# EAGLE design SNES-ModChip-v1 (EAGLE 6.5.0)
CNAME: SNES ModChip; CREVISION: A; DESIGNER: Philip Dubois
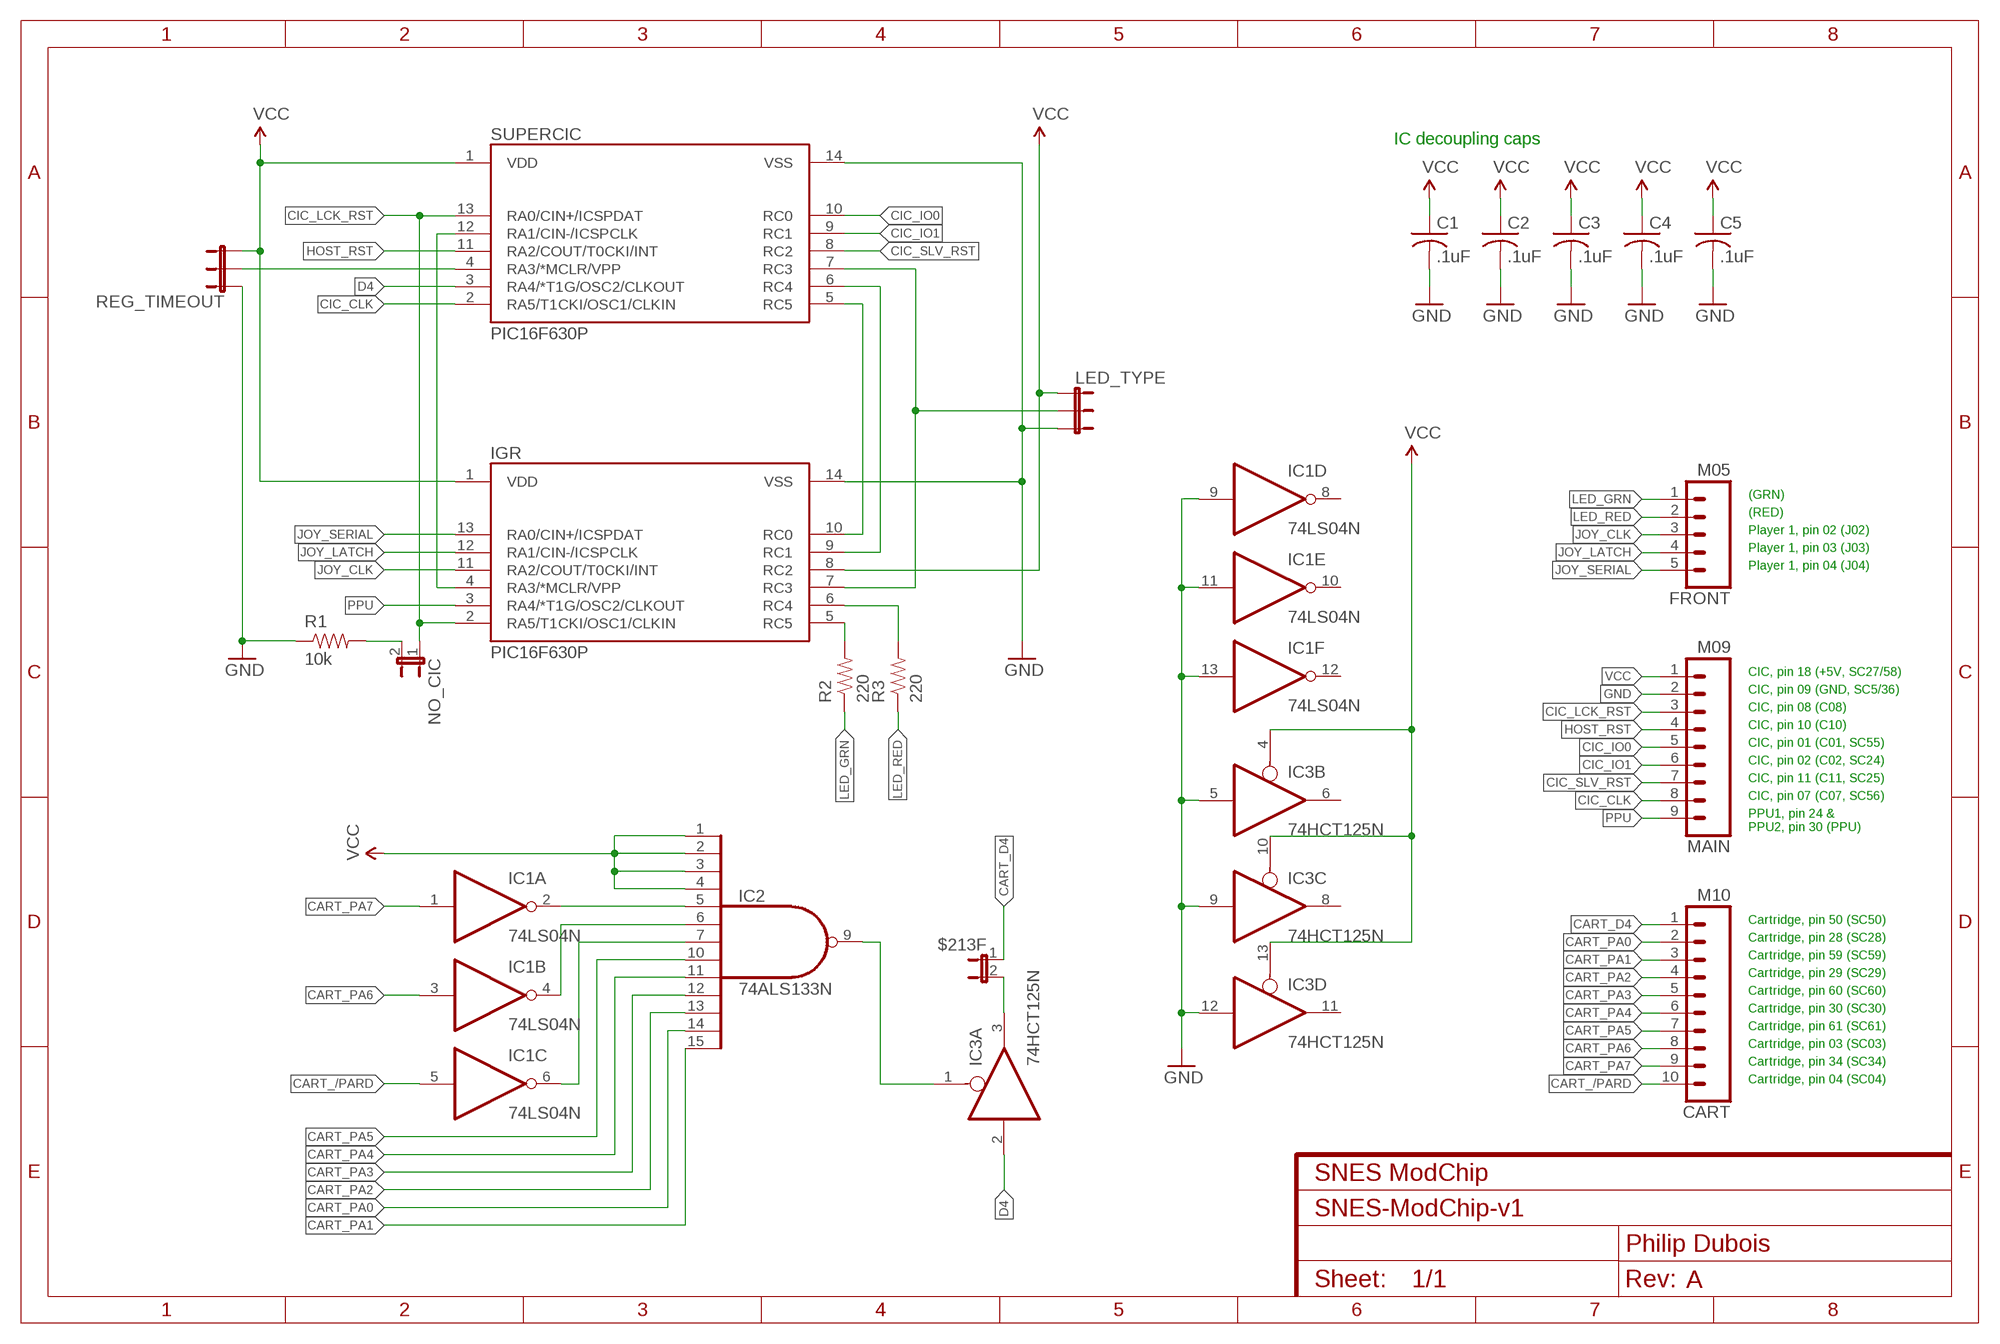
[diagram p0: schematic, sheet 1]

## Parts
$213F  JUMPER-2PTH  [1X02]
C1  .1uF  C-US050-025X075  [C050-025X075]
C2  .1uF  C-US050-025X075  [C050-025X075]
C3  .1uF  C-US050-025X075  [C050-025X075]
C4  .1uF  C-US050-025X075  [C050-025X075]
C5  .1uF  C-US050-025X075  [C050-025X075]
CART  M10  [1X10]
FRONT  M05  [1X05]
IC1  74LS04N  [DIL14]
IC2  74ALS133N  [DIL16]
IC3  74HCT125N  [DIL14]
IGR  PIC16F630P  [DIL14]
LED_TYPE  JUMPER-3PTH  [1X03]
MAIN  M09  [1X09]
NO_CIC  JUMPER-2PTH  [1X02]
R1  10k  RESISTORPTH  [AXIAL-0.3]
R2  220  RESISTORPTH  [AXIAL-0.3]
R3  220  RESISTORPTH  [AXIAL-0.3]
REG_TIMEOUT  JUMPER-3PTH  [1X03]
SUPERCIC  PIC16F630P  [DIL14]

## Nets
CART_/PARD: CART.10 IC1.5(C:I)
CART_D4: $213F.1 CART.1
CART_PA0: CART.2 IC2.14(I11)
CART_PA1: CART.3 IC2.15(I12)
CART_PA2: CART.4 IC2.13(I10)
CART_PA3: CART.5 IC2.12(I9)
CART_PA4: CART.6 IC2.11(I8)
CART_PA5: CART.7 IC2.10(I7)
CART_PA6: CART.8 IC1.3(B:I)
CART_PA7: CART.9 IC1.1(A:I)
CIC_CLK: MAIN.8 SUPERCIC.2(RA5/T1CKI/OSC1/CLKIN)
CIC_IO0: MAIN.5 SUPERCIC.10(RC0)
CIC_IO1: MAIN.6 SUPERCIC.9(RC1)
CIC_LCK_RST: IGR.2(RA5/T1CKI/OSC1/CLKIN) MAIN.3 NO_CIC.1 SUPERCIC.13(RA0/CIN+/ICSPDAT)
CIC_SLV_RST: MAIN.7 SUPERCIC.8(RC2)
D4: IC3.2(A:I) SUPERCIC.3(RA4/*T1G/OSC2/CLKOUT)
GND: C1.2 C2.2 C3.2 C4.2 C5.2 IC1.9(D:I) IC1.11(E:I) IC1.13(F:I) IC3.5(B:I) IC3.9(C:I) IC3.12(D:I) IGR.14(VSS) LED_TYPE.3 MAIN.2 R1.P$1 REG_TIMEOUT.1 SUPERCIC.14(VSS)
HOST_RST: MAIN.4 SUPERCIC.11(RA2/COUT/T0CKI/INT)
JOY_CLK: FRONT.3 IGR.11(RA2/COUT/T0CKI/INT)
JOY_LATCH: FRONT.4 IGR.12(RA1/CIN-/ICSPCLK)
JOY_SERIAL: FRONT.5 IGR.13(RA0/CIN+/ICSPDAT)
LED_GRN: FRONT.1 R2.P$1
LED_RED: FRONT.2 R3.P$1
N$1: IGR.10(RC0) SUPERCIC.5(RC5)
N$2: IGR.9(RC1) SUPERCIC.6(RC4)
N$5: IC1.2(A:O) IC2.5(I4)
N$6: IGR.4(RA3/*MCLR/VPP) SUPERCIC.12(RA1/CIN-/ICSPCLK)
N$7: IC1.4(B:O) IC2.6(I5)
N$8: IC1.6(C:O) IC2.7(I6)
N$9: REG_TIMEOUT.2 SUPERCIC.4(RA3/*MCLR/VPP)
N$10: IGR.7(RC3) LED_TYPE.2 SUPERCIC.7(RC3)
N$11: NO_CIC.2 R1.P$2
N$12: $213F.2 IC3.3(A:O)
N$13: IGR.5(RC5) R2.P$2
N$14: IGR.6(RC4) R3.P$2
N$19: IC2.9(O) IC3.1(A:OE)
PPU: IGR.3(RA4/*T1G/OSC2/CLKOUT) MAIN.9
VCC: C1.1 C2.1 C3.1 C4.1 C5.1 IC2.1(I0) IC2.2(I1) IC2.3(I2) IC2.4(I3) IC3.4(B:OE) IC3.10(C:OE) IC3.13(D:OE) IGR.1(VDD) IGR.8(RC2) LED_TYPE.1 MAIN.1 REG_TIMEOUT.3 SUPERCIC.1(VDD)
Unconnected: IC1.8(D:O) IC1.10(E:O) IC1.12(F:O) IC3.6(B:O) IC3.8(C:O) IC3.11(D:O)

## Notes on the sheet
- IC decoupling caps
- (GRN)
- (RED)
- Player 1, pin 02 (J02)
- Player 1, pin 03 (J03)
- Player 1, pin 04 (J04)
- CIC, pin 18 (+5V, SC27/58)
- CIC, pin 09 (GND, SC5/36)
- CIC, pin 08 (C08)
- CIC, pin 10 (C10)
- CIC, pin 01 (C01, SC55)
- CIC, pin 02 (C02, SC24)
- CIC, pin 11 (C11, SC25)
- CIC, pin 07 (C07, SC56)
- PPU1, pin 24 &
  PPU2, pin 30 (PPU)
- Cartridge, pin 50 (SC50)
- Cartridge, pin 28 (SC28)
- Cartridge, pin 59 (SC59)
- Cartridge, pin 29 (SC29)
- Cartridge, pin 60 (SC60)
- Cartridge, pin 30 (SC30)
- Cartridge, pin 61 (SC61)
- Cartridge, pin 03 (SC03)
- Cartridge, pin 34 (SC34)
- Cartridge, pin 04 (SC04)

## Power pins joined to a net without a drawn wire
GND: IC1.7(P:GND) IC2.8(GND) IC3.7(P:GND)
VCC: IC1.14(P:VCC) IC2.16(VCC) IC3.14(P:VCC)

## Library data of the parts
$213F NO_CIC = SparkFun-Passives:JUMPER-2: Jumper Basic 0.1" spaced jumper. Use with breakaway headers.
C1-C5 = resistor-edited:C-US: CAPACITOR, American symbol
CART = MyLibrary:M10: Header 10 Standard 10-pin 0.1" header. Use with straight break away headers, right angle break away headers, swiss pins, machine pins, and female headers.
FRONT = MyLibrary:M05: Header 5 Standard 5-pin 0.1" header. Use with straight break away headers, right angle break away headers, swiss pins, machine pins, and female headers.
IC1 = MyLibrary:74*04: Hex INVERTER These devices contain six independent inverters.
IC2 = MyLibrary:74*133: 13-input positive NAND gate These devices contain a 13-input positive-NAND gate.
IC3 = MyLibrary:74*125: Quadruple bus BUFFER gate with 3-state output These bus buffer gates feature independent line drivers with 3-state outputs. Each output is disabled when the associated output-enable (*OE) input is high. To ensure the high-impedance state during power up or power down, *OE should be tied to VCC through a pullup resistor; the minimum value of the resistor is determined by the current-sinking capability of the driver.
IGR SUPERCIC = MyLibrary:PIC16F630: Microchip PIC16F630 14-Pin, Flash-Based 8-Bit CMOS Microcontrollers
LED_TYPE REG_TIMEOUT = SparkFun-Passives:JUMPER-3
MAIN = MyLibrary:M09: Header 9 Standard 9-pin 0.1" header. Use with straight break away headers, right angle break away headers, swiss pins, machine pins, and female headers.
R1-R3 = MyLibrary:RESISTOR: Resistor Basic schematic elements and footprints for 0402, 0603, 0805, and PTH resistors.

## Net classes
0 default: width 0.508 mm, drill 0.61 mm, clearance 0.305 mm

## Board
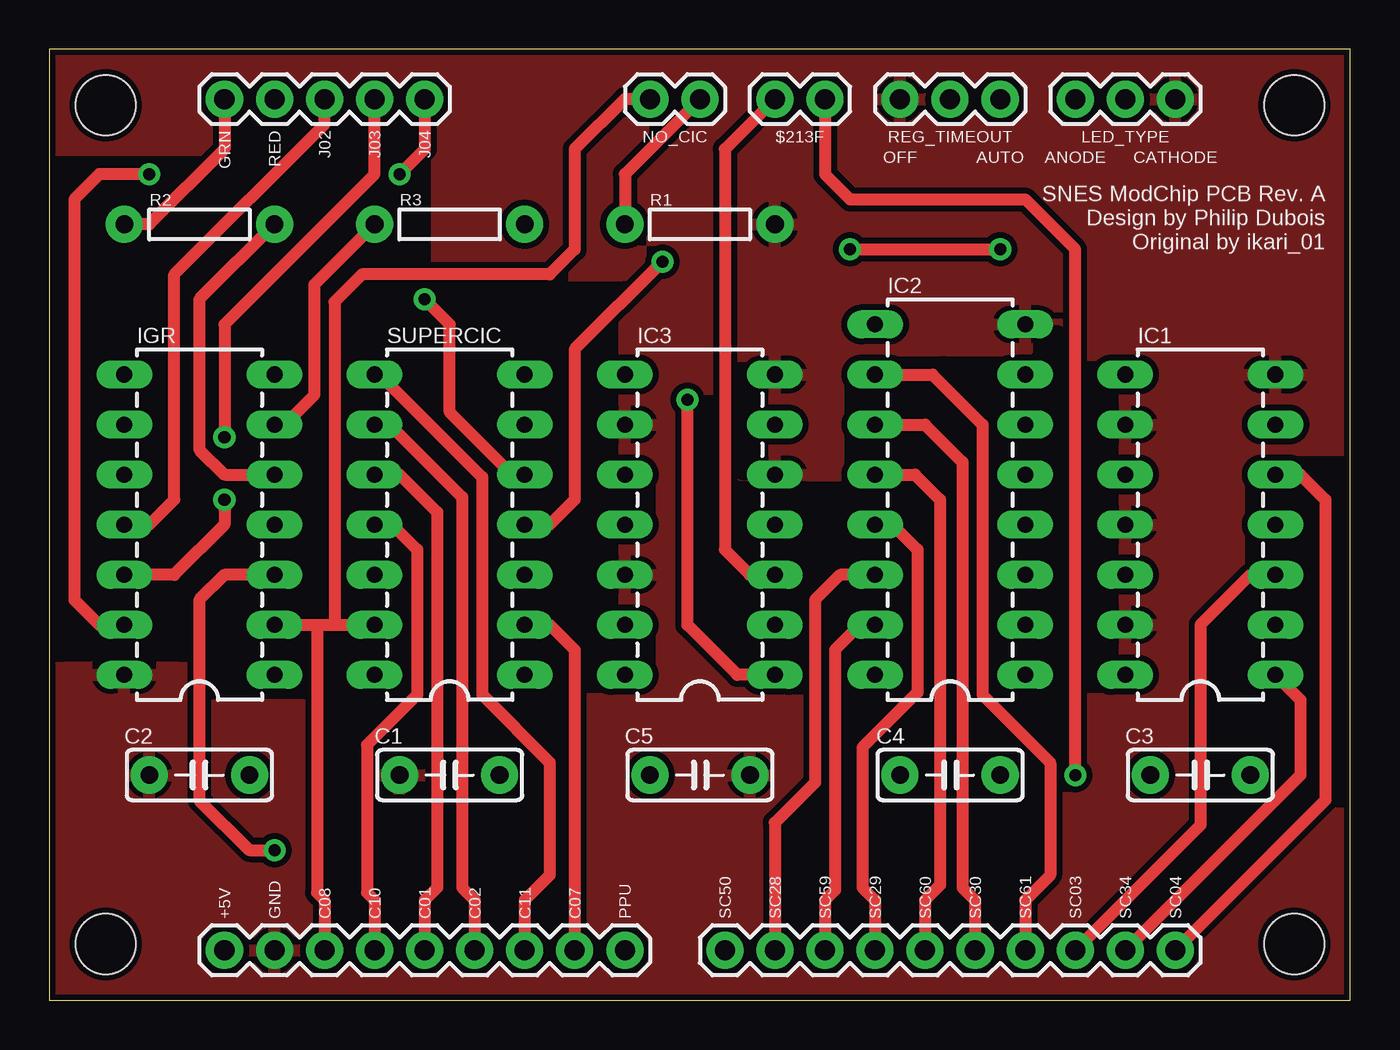
[diagram p1: board, top side]
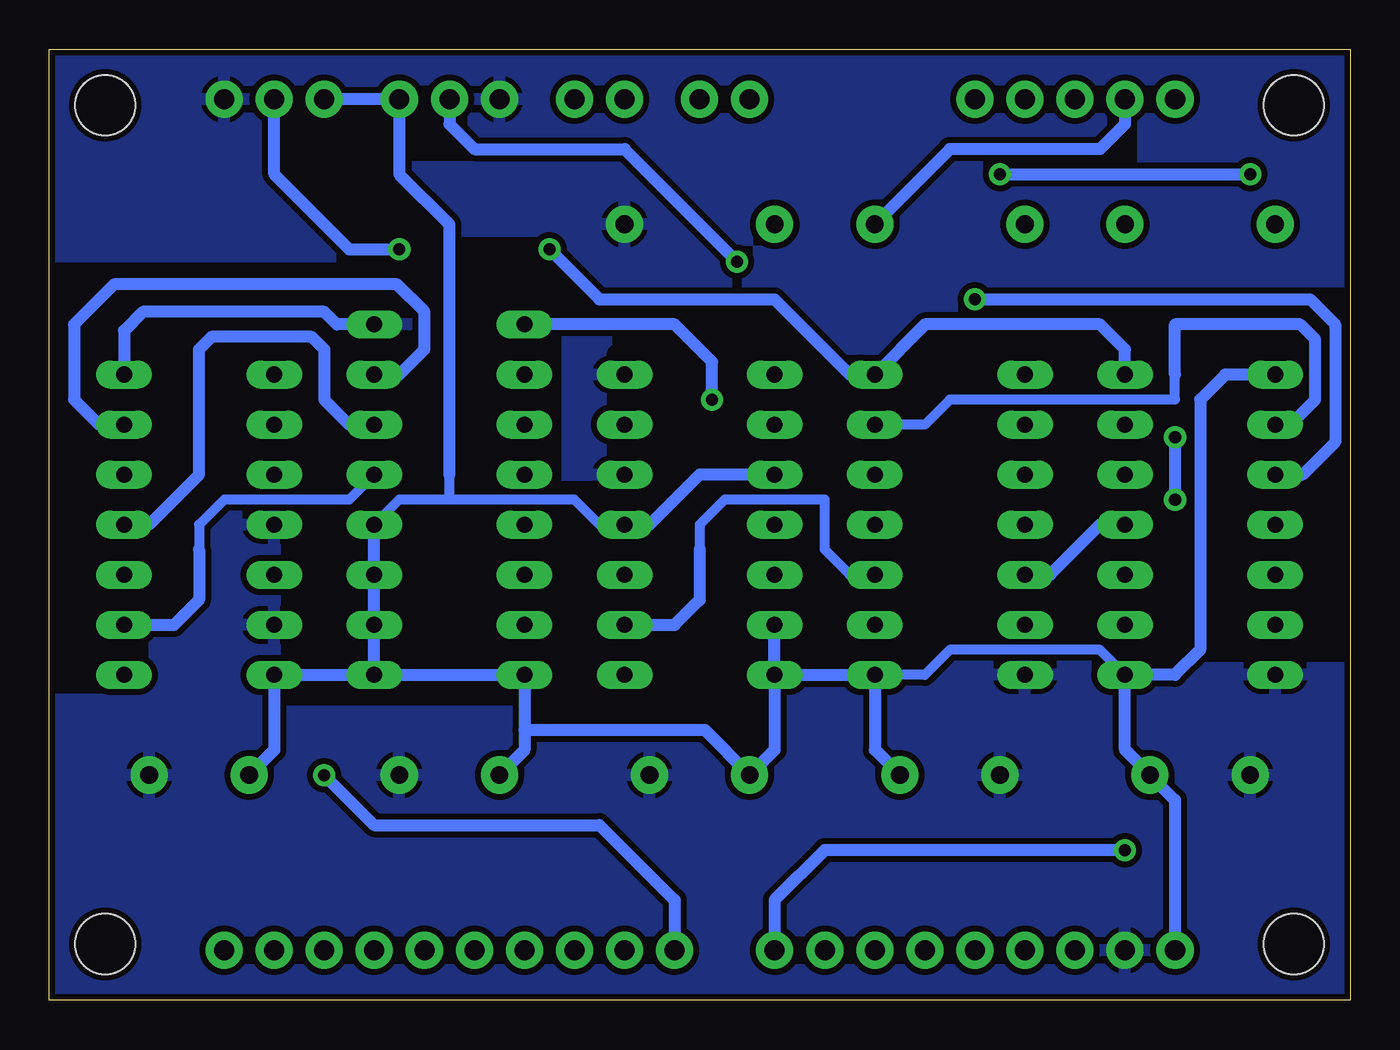
[diagram p2: board, bottom side, seen from below]

Size 66.03 x 48.25 mm. Coordinates in mm from the lower left corner, seen from the top.
Outline: 0,0 66.03,0 66.03,48.25 0,48.25 0,0
Copper layers (1*16): Top 0.035mm / dielectric 1.5mm / Bottom 0.035mm
Design rules "SparkFun-2-layer": minimum track width 7mil, minimum drill 15mil, track to track 8mil, track to pad 8mil, pad to pad 8mil, via to via 8mil, smd to smd 8mil, copper to edge 8mil, drill to drill 8mil, minimum pad ring 12mil, minimum via ring 10mil, stop-mask expansion 4mil, vias tented up to drill 20mil, thermal gap 10mil
Holes 3.05 mm at 2.86,45.4 63.18,45.4 63.18,2.86 2.86,2.86
tRestrict: area 17.1,4.1 to 18.7,9.8; area 0.6,17.8 to 6.7,20.6; area 14.6,12.7 to 17.8,18.1; area 8.6,15.9 to 13.7,29.5; area 0.6,41.6 to 8.3,42.2; area 15.6,37.8 to 18.7,42.9; area 61.3,17.1 to 65.4,27; area 59.4,8.9 to 62.9,20.3; area 53,16.2 to 53.7,31.1; area 42.9,29.5 to 51.1,33.7; area 35.2,21.6 to 44.1,25.7; area 35.2,27 to 35.9,31.8; 7 more areas
bRestrict: area 0.6,35.2 to 1.9,35.6; area 11.4,42.2 to 11.7,44.1; area 44.8,43.2 to 48.3,45.1; area 61.6,16.2 to 65.7,29.8; area 49.5,19.7 to 65.7,36.8; area 50.5,17.5 to 53.7,24.4; area 39.4,26 to 45.1,38.1; area 24.8,25.1 to 28.3,34.3; area 30.2,13 to 41.3,25.7; area 42.5,15.6 to 53.7,16.5; area 0.6,17.8 to 7.3,30.8; area 12.4,18.7 to 15.6,22.5; 3 more areas

### Footprints (pad centres in the part's own frame; a part is rotated, then mirrored left to right if it is on the bottom)
1X02 = drill 1.016 pad 1.88: 1 0,0; 2 2.54,0
C050-025X075 = drill 0.9 pad 1.88: 1 -2.54,0; 2 2.54,0
1X10 = drill 1.016 pad 1.88: 1 0,0; 2 2.54,0; 3 5.08,0; 4 7.62,0; 5 10.16,0; 6 12.7,0; 7 15.24,0; 8 17.78,0; 9 20.32,0; 10 22.86,0
1X05 = drill 1.016 pad 1.88: 1 0,0; 2 2.54,0; 3 5.08,0; 4 7.62,0; 5 10.16,0
DIL14 = drill 0.813 long: 1 -7.62,-3.81; 2 -5.08,-3.81; 3 -2.54,-3.81; 4 0,-3.81; 5 2.54,-3.81; 6 5.08,-3.81; 7 7.62,-3.81; 8 7.62,3.81; 9 5.08,3.81; 10 2.54,3.81; 11 0,3.81; 12 -2.54,3.81; 13 -5.08,3.81; 14 -7.62,3.81
DIL16 = drill 0.813 long: 1 -8.89,-3.81; 2 -6.35,-3.81; 3 -3.81,-3.81; 4 -1.27,-3.81; 5 1.27,-3.81; 6 3.81,-3.81; 7 6.35,-3.81; 8 8.89,-3.81; 9 8.89,3.81; 10 6.35,3.81; 11 3.81,3.81; 12 1.27,3.81; 13 -1.27,3.81; 14 -3.81,3.81; 15 -6.35,3.81; 16 -8.89,3.81
1X03 = drill 1.016 pad 1.88: 1 0,0; 2 2.54,0; 3 5.08,0
1X09 = drill 1.016 pad 1.88: 1 0,0; 2 2.54,0; 3 5.08,0; 4 7.62,0; 5 10.16,0; 6 12.7,0; 7 15.24,0; 8 17.78,0; 9 20.32,0
AXIAL-0.3 = drill 0.9 pad 1.88: P$1 -3.81,0; P$2 3.81,0

### Placement (x,y rotation side)
$213F  39.37,45.72 180 top
C1  20.32,11.43 180 top
C2  7.62,11.43 180 top
C3  58.42,11.43 0 top
C4  45.72,11.43 0 top
C5  33.02,11.43 0 top
CART  34.29,2.54 0 top
FRONT  8.89,45.72 0 top
IC1  58.42,24.13 90 top
IC2  45.72,25.4 90 top
IC3  33.02,24.13 90 top
IGR  7.62,24.13 90 top
LED_TYPE  52.07,45.72 0 top
MAIN  8.89,2.54 0 top
NO_CIC  30.48,45.72 0 top
R1  33.02,39.37 180 top
R2  7.62,39.37 0 top
R3  20.32,39.37 180 top
REG_TIMEOUT  43.18,45.72 0 top
SUPERCIC  20.32,24.13 90 top

### Tracks (layer width: path | path; a pad name or v marks a point on that pad's centre or on a via)
CART_/PARD
  Top 0.61: IC1.5 63.5,26.67 64.77,25.4 64.77,10.16 CART.10
CART_D4  (via drill 0.61)
  Top 0.61: $213F.1 39.37,41.91 40.64,40.64 49.53,40.64 52.07,38.1 v52.07,11.43
  Bottom 0.61: v52.07,11.43 49.53,8.89 38.1,8.89 34.29,5.08 CART.1
CART_PA0
  Top 0.61: IC2.14 40.13,21.59 38.86,20.32 38.86,11.05 36.83,9.02 CART.2
CART_PA1
  Top 0.61: IC2.15 41.15,19.05 39.88,17.78 39.88,5.59 39.37,5.08 CART.3
CART_PA2
  Top 0.61: IC2.13 42.8,24.13 44.07,22.86 44.07,15.62 41.27,12.83 41.27,5.71 41.91,5.08 CART.4
CART_PA3
  Top 0.61: IC2.12 43.94,26.67 45.21,25.4 45.21,5.84 44.45,5.08 CART.5
CART_PA4
  Top 0.61: IC2.11 44.45,29.21 46.35,27.3 46.35,5.71 46.99,5.08 CART.6
CART_PA5
  Top 0.61: IC2.10 44.83,31.75 47.37,29.21 47.37,15.49 50.8,12.06 50.8,6.35 49.53,5.08 CART.7
CART_PA6
  Top 0.61: IC1.3 60.96,21.59 58.42,19.05 58.42,8.89 CART.8
CART_PA7
  Top 0.61: IC1.1 63.5,15.24 63.5,11.43 CART.9
CIC_CLK
  Top 0.61: SUPERCIC.2 25.4,19.05 26.67,17.78 MAIN.8
CIC_IO0
  Top 0.61: SUPERCIC.10 17.78,26.67 19.68,24.77 19.68,5.71 19.05,5.08 MAIN.5
CIC_IO1
  Top 0.61: SUPERCIC.9 17.27,29.21 20.95,25.53 20.95,5.71 21.59,5.08 MAIN.6
CIC_LCK_RST
  Top 0.61: IGR.2 13.59,19.05 | 13.59,19.05 14.35,19.05 | 14.35,19.05 SUPERCIC.13 | NO_CIC.1 29.21,45.72 26.67,43.18 26.67,38.1 25.4,36.83 15.88,36.83 14.48,35.43 14.48,19.18 14.35,19.05 | 13.59,19.05 13.59,5.46 13.97,5.08 MAIN.3
CIC_SLV_RST
  Top 0.61: SUPERCIC.8 16.76,31.75 21.97,26.54 21.97,15.49 25.4,12.06 25.4,6.35 24.13,5.08 MAIN.7
D4
  Bottom 0.508: SUPERCIC.3 25.4,21.59 26.67,22.86 26.67,25.4 31.75,25.4 33.02,24.13 33.02,22.86
  Bottom 0.61: IC3.2 34.29,19.05 33.02,20.32 33.02,22.86
GND
  Bottom 0.61: IC2.8 51.44,34.29 52.07,34.92 61.28,34.92 62.23,33.97 IC1.7
  pour Top (isolate 0.305): -1.27,49.53 67.31,49.53 67.31,-1.27 -1.27,-1.27
  pour Bottom (isolate 0.305): -2.54,50.8 68.58,50.8 68.58,-2.54 -2.54,-2.54
HOST_RST
  Top 0.61: SUPERCIC.11 17.4,24.13 18.67,22.86 18.67,15.49 16.13,12.95 16.13,5.46 16.51,5.08 MAIN.4
JOY_CLK
  Top 0.61: IGR.11 5.08,24.13 6.35,25.4 6.35,36.83 13.97,44.45 FRONT.3
JOY_LATCH  (via drill 0.61)
  Top 0.61: v8.89,28.57 8.89,34.29 16.51,41.91 FRONT.4 | v8.89,25.4 8.89,24.13 6.35,21.59 IGR.12
  Bottom 0.61: v8.89,28.57 v8.89,25.4
JOY_SERIAL  (via drill 0.61)
  Top 0.61: FRONT.5 19.05,43.18 v17.78,41.91 | v5.08,41.91 2.54,41.91 1.27,40.64 1.27,20.32 2.54,19.05 IGR.13
  Bottom 0.61: v17.78,41.91 v5.08,41.91
LED_GRN
  Top 0.61: FRONT.1 8.89,43.18 5.08,39.37 R2.P$1
LED_RED
  Bottom 0.61: FRONT.2 11.43,44.45 12.7,43.18 20.32,43.18 R3.P$1
N$1  (via drill 0.61)
  Top 0.61: SUPERCIC.5 23.5,26.67 20.32,29.84 20.32,34.29 v19.05,35.56
  Bottom 0.61: IGR.10 2.41,26.67 0.76,28.32 0.76,34.29 2.03,35.56 v19.05,35.56
N$2
  Bottom 0.508: 8.89,31.75 8.89,30.48 20.32,30.48 21.59,29.21 SUPERCIC.6
  Bottom 0.61: IGR.9 3.05,29.21 1.78,30.48 1.78,33.53 2.54,34.29 8.89,34.29 8.89,31.75
N$5
  Bottom 0.508: IC2.5 50.8,25.4 57.15,25.4 58.42,24.13 58.42,22.86
  Bottom 0.61: IC1.2 59.69,19.05 58.42,20.32 58.42,22.86
N$6
  Bottom 0.61: IGR.4 12.7,24.13 15.24,21.59 SUPERCIC.12
N$7
  Bottom 0.61: IC1.4 60.96,24.13 58.42,26.67 58.42,33.02 57.78,33.66 52.7,33.66 52.07,33.02 52.07,30.48 50.8,29.21 IC2.6
N$8
  Bottom 0.61: IC2.7 48.26,31.75 46.99,33.02 46.99,34.92 48.39,36.32 62.74,36.32 64.77,34.29 64.77,30.48 63.5,29.21 IC1.6
N$9  (via drill 0.61)
  Top 0.61: SUPERCIC.4 25.4,24.13 26.67,25.4 26.67,33.02 v31.11,37.47
  Bottom 0.61: REG_TIMEOUT.2 45.72,44.45 44.45,43.18 36.83,43.18 v31.11,37.47
N$10  (via drill 0.61)
  Top 0.61: v40.64,38.1 v48.26,38.1
  Bottom 0.61: LED_TYPE.2 54.61,41.91 50.8,38.1 v48.26,38.1 | v40.64,38.1 38.1,35.56 29.21,35.56 25.4,31.75 SUPERCIC.7 21.59,34.29 12.7,34.29 11.43,33.02 IGR.7
N$11
  Top 0.61: NO_CIC.2 29.21,41.91 R1.P$2
N$12
  Top 0.61: $213F.2 34.29,43.18 34.29,22.86 35.56,21.59 IC3.3
N$13
  Top 0.61: R2.P$2 7.62,35.56 7.62,27.94 8.89,26.67 IGR.5
N$14
  Top 0.61: R3.P$2 13.46,36.32 13.46,30.73 11.94,29.21 IGR.6
N$19  (via drill 0.61)
  Top 0.61: v32.38,30.48 32.38,19.05 34.92,16.51 IC3.1
  Bottom 0.61: v32.38,30.48 32.38,32.38 34.29,34.29 IC2.9
PPU  (via drill 0.61)
  Top 0.61: IGR.3 8.89,21.59 7.62,20.32 7.62,10.16 10.16,7.62 v11.43,7.62
  Bottom 0.61: v11.43,7.62 26.67,7.62 29.21,5.08 MAIN.9
VCC
  Bottom 0.508: IC2.4 48.26,25.4 45.72,25.4 | IC3.4 38.1,24.13 39.37,25.4 45.72,25.4 | 45.72,25.4 45.72,26.67 | SUPERCIC.1 21.59,16.51 20.32,17.78 12.7,17.78 IGR.1
  Bottom 0.61: C3.1 54.61,12.7 IC1.14 IC2.1 | IC2.1 IC2.2 IC2.3 IC2.4 | IC2.1 IC2.16 41.91,13.72 | IC3.14 29.21,12.7 C5.1 32.77,13.72 41.91,13.72 | 41.91,13.72 41.91,12.7 C4.1 | IC3.14 SUPERCIC.1 24.13,12.7 C1.1 | IC3.14 IC3.13 | IC3.10 33.02,26.67 35.56,24.13 IC3.4 | MAIN.1 8.89,10.16 C2.1 11.43,12.7 IGR.1 8.89,16.51 7.62,17.78 7.62,30.48 6.35,31.75 IGR.8 | LED_TYPE.1 REG_TIMEOUT.3 48.26,41.91 45.72,39.37 45.72,26.67

### Text on the board
tPlace: GRN | RED | J02 | J03 | J04 | OFF | AUTO | ANODE | CATHODE | SNES ModChip PCB Rev. A / Design by Philip Dubois / Original by ikari_01 | +5V | GND | C08 | C10 | C01 | C02 | C11 | C07 | PPU | SC50 | SC28 | SC59 | SC29 | SC60 | SC30 | SC61 | SC03 | SC34 | SC04